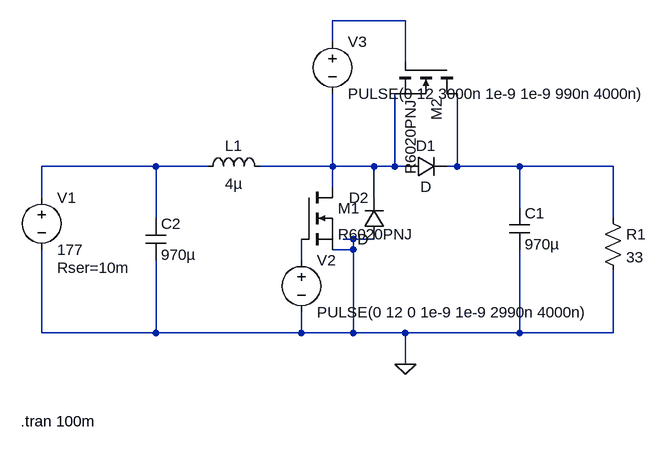
[diagram p0: schematic SynchronousBoost.asc]
SynchronousBoost.asc, the LTspice schematic file:
Version 4
SHEET 1 984 680
WIRE 128 -160 16 -160
WIRE 16 -128 16 -160
WIRE 128 -96 128 -160
WIRE -256 64 -432 64
WIRE -176 64 -256 64
WIRE 16 64 16 -48
WIRE 16 64 -96 64
WIRE 80 64 16 64
WIRE 112 64 112 -48
WIRE 112 64 80 64
WIRE 128 64 112 64
WIRE 208 64 208 -48
WIRE 208 64 192 64
WIRE 304 64 208 64
WIRE 448 64 304 64
WIRE 16 96 16 64
WIRE -432 112 -432 64
WIRE 80 112 80 64
WIRE 304 128 304 64
WIRE -256 144 -256 64
WIRE 448 144 448 64
WIRE 48 176 32 176
WIRE 80 176 48 176
WIRE 48 192 48 176
WIRE 48 192 16 192
WIRE -32 208 -32 176
WIRE -432 320 -432 192
WIRE -256 320 -256 208
WIRE -256 320 -432 320
WIRE -32 320 -32 288
WIRE -32 320 -256 320
WIRE 48 320 48 192
WIRE 48 320 -32 320
WIRE 128 320 48 320
WIRE 304 320 304 192
WIRE 304 320 128 320
WIRE 448 320 448 224
WIRE 448 320 304 320
WIRE 128 368 128 320
FLAG 128 368 0
SYMBOL ind -192 80 R270
WINDOW 0 32 56 VTop 2
WINDOW 3 5 56 VBottom 2
SYMATTR InstName L1
SYMATTR Value 4µ
SYMATTR SpiceLine Rser=0.1m
SYMBOL voltage -32 192 R0
WINDOW 123 0 0 Left 0
WINDOW 39 0 0 Left 0
SYMATTR InstName V2
SYMATTR Value PULSE(0 12 0 1e-9 1e-9 2990n 4000n)
SYMBOL cap 288 128 R0
SYMATTR InstName C1
SYMATTR Value 970µ
SYMATTR SpiceLine V=900 Rser=0.3m
SYMBOL voltage -432 96 R0
WINDOW 123 0 0 Left 0
WINDOW 39 24 124 Left 2
SYMATTR SpiceLine Rser=10m
SYMATTR InstName V1
SYMATTR Value 177
SYMBOL diode 128 80 R270
WINDOW 0 32 32 VTop 2
WINDOW 3 0 32 VBottom 2
SYMATTR InstName D1
SYMBOL nmos -32 96 R0
SYMATTR InstName M1
SYMATTR Value R6020PNJ
SYMBOL cap -272 144 R0
SYMATTR InstName C2
SYMATTR Value 970µ
SYMATTR SpiceLine Rser=0.3m
SYMBOL res 432 128 R0
SYMATTR InstName R1
SYMATTR Value 33
SYMBOL nmos 208 -96 R90
SYMATTR InstName M2
SYMATTR Value R6020PNJ
SYMBOL voltage 16 -144 R0
WINDOW 123 0 0 Left 0
WINDOW 39 0 0 Left 0
SYMATTR InstName V3
SYMATTR Value PULSE(0 12 3000n 1e-9 1e-9 990n 4000n)
SYMBOL diode 96 176 R180
WINDOW 0 24 64 Left 2
WINDOW 3 24 0 Left 2
SYMATTR InstName D2
TEXT -464 456 Left 2 !.tran 100m

The netlist it stands for:
* SynchronousBoost.asc
L1 N002 N003 4µ Rser=0.1m
V2 N005 0 PULSE(0 12 0 1e-9 1e-9 2990n 4000n)
C1 N004 0 970µ V=900 Rser=0.3m
V1 N002 0 177 Rser=10m
D1 N003 N004 D
M1 N003 N005 0 0 R6020PNJ
C2 N002 0 970µ Rser=0.3m
R1 N004 0 33
M2 N004 N001 N003 N003 R6020PNJ
V3 N001 N003 PULSE(0 12 3000n 1e-9 1e-9 990n 4000n)
D2 0 N003 D
.model D D
.lib standard.dio
.model NMOS NMOS
.model PMOS PMOS
.lib standard.mos
.tran 100m
.backanno
.end